# EAGLE design page1 (EAGLE 5.11)
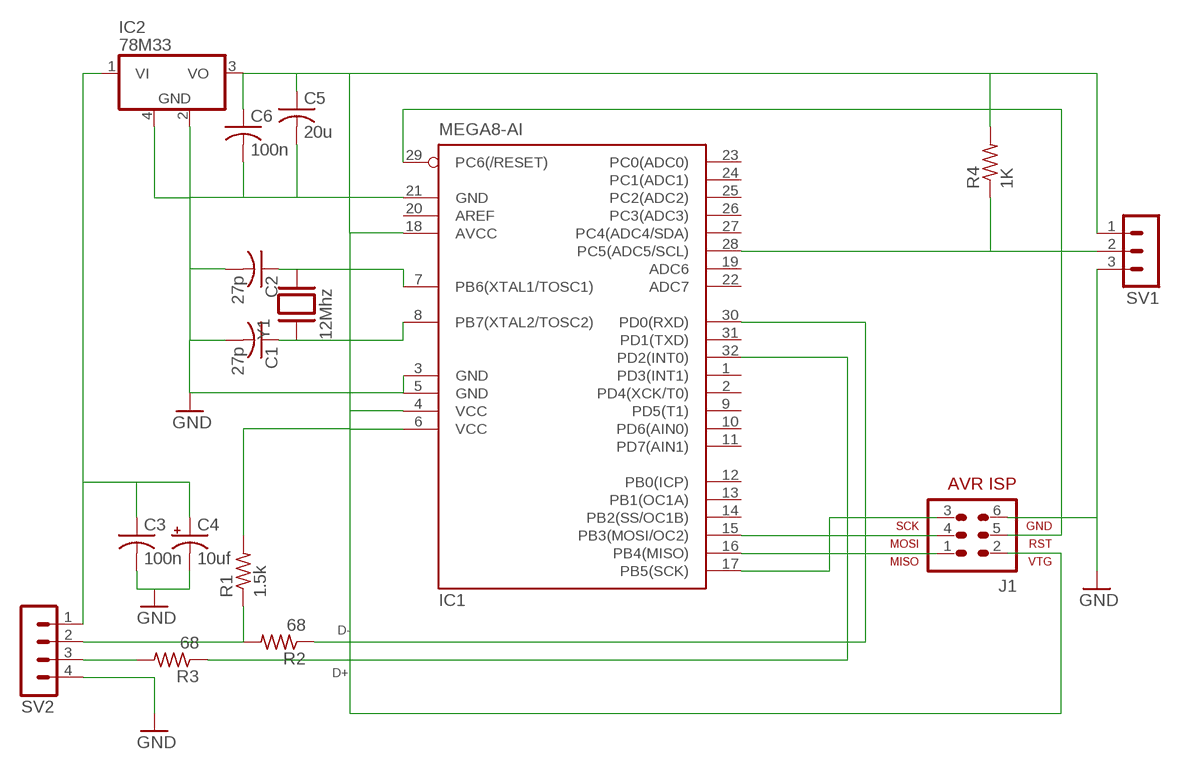
[diagram p0: schematic, sheet 1]

## Parts
C1  27p  C-USC0603  [C0603]
C2  27p  C-USC0603  [C0603]
C3  100n  C-USC1206  [C1206]
C4  10uf  CPOL-US085CS-1AR  [085CS_1AR]
C5  20u  C-USC2220K  [C2220K]
C6  100n  C-USC1206  [C1206]
IC1  MEGA8-AI  [TQFP32-08]
IC2  78M33  LM340MP-05  [SOT223]
J1  AVR-ISP-6  [AVR-ISP-6]
R1  1.5k  R-US_R0805  [R0805]
R2  68  R-US_R0805  [R0805]
R3  68  R-US_R0805  [R0805]
R4  1K  R-US_R0805  [R0805]
SV1  MA03-1  [MA03-1]
SV2  MA04-1  [MA04-1]
Y1  12Mhz  X-TAL  [XTAL]

## Nets
D+: R3.2 SV2.3
D-: R1.1 R2.2 SV2.2
GND: C1.2 C2.2 C3.2 C4.- C5.2 C6.2 IC1.3(GND) IC1.5(GND) IC1.21(GND) IC2.2(GND1) IC2.4(GND) J1.6 SV1.3 SV2.4
MISO: IC1.16(PB4(MISO)) J1.1
MOSI: IC1.15(PB3(MOSI/OC2)) J1.4
N$1: C3.1 C4.+ IC2.1(VI) SV2.1
N$3: C2.1 IC1.7(PB6(XTAL1/TOSC1)) Y1.P$2
N$4: C1.1 IC1.8(PB7(XTAL2/TOSC2)) Y1.P$1
N$10: IC1.30(PD0(RXD)) R2.1
N$12: IC1.32(PD2(INT0)) R3.1
N$21: IC1.28(PC5(ADC5/SCL)) R4.1 SV1.2
RST: IC1.29(PC6(/RESET)) J1.5
SCK: IC1.17(PB5(SCK)) J1.3
V3_3: C5.1 C6.1 IC1.4(VCC) IC1.6(VCC) IC1.18(AVCC) IC2.3(VO) J1.2 R1.2 R4.2 SV1.1
Unconnected: IC1.1(PD3(INT1)) IC1.2(PD4(XCK/T0)) IC1.9(PD5(T1)) IC1.10(PD6(AIN0)) IC1.11(PD7(AIN1)) IC1.12(PB0(ICP)) IC1.13(PB1(OC1A)) IC1.14(PB2(SS/OC1B)) IC1.19(ADC6) IC1.20(AREF) IC1.22(ADC7) IC1.23(PC0(ADC0)) IC1.24(PC1(ADC1)) IC1.25(PC2(ADC2)) IC1.26(PC3(ADC3)) IC1.27(PC4(ADC4/SDA)) IC1.31(PD1(TXD))

## Notes on the sheet
- D-
- D+

## Library data of the parts
C1-C3 C5 C6 = rcl:C-US: CAPACITOR, American symbol
C4 = rcl:CPOL-US: POLARIZED CAPACITOR, American symbol
IC1 = atmel:MEGA8: MICROCONTROLLER 8 Kbytes FLASH, 1 kbytes SRAM, 512 bytes EEPROM, USART, 6-channel 10 bit ADC, 2-channel 8 bit ADC Pin compatible with Atmega48, ATMega88, ATMega168 Source: avr.lbr; MPN: ATMEGA8-16AU; OC_FARNELL: 9171371; OC_NEWARK: 73M8863
IC2 = MY_ATMEL:LM340?-*: Positive VOLTAGE REGULATOR Source: http://cache.national.com/ds/LM/LM340.pdf
J1 = atmel2:AVR-ISP-6: AVR ISP-6 Serial Programming Header
R1-R4 = rcl:R-US_: RESISTOR, American symbol
SV1 = con-lstb:MA03-1: PIN HEADER; OC_FARNELL: unknown; OC_NEWARK: unknown
SV2 = con-lstb:MA04-1: PIN HEADER; OC_FARNELL: unknown; OC_NEWARK: unknown
Y1 = dedenbear:X-TAL

## Board
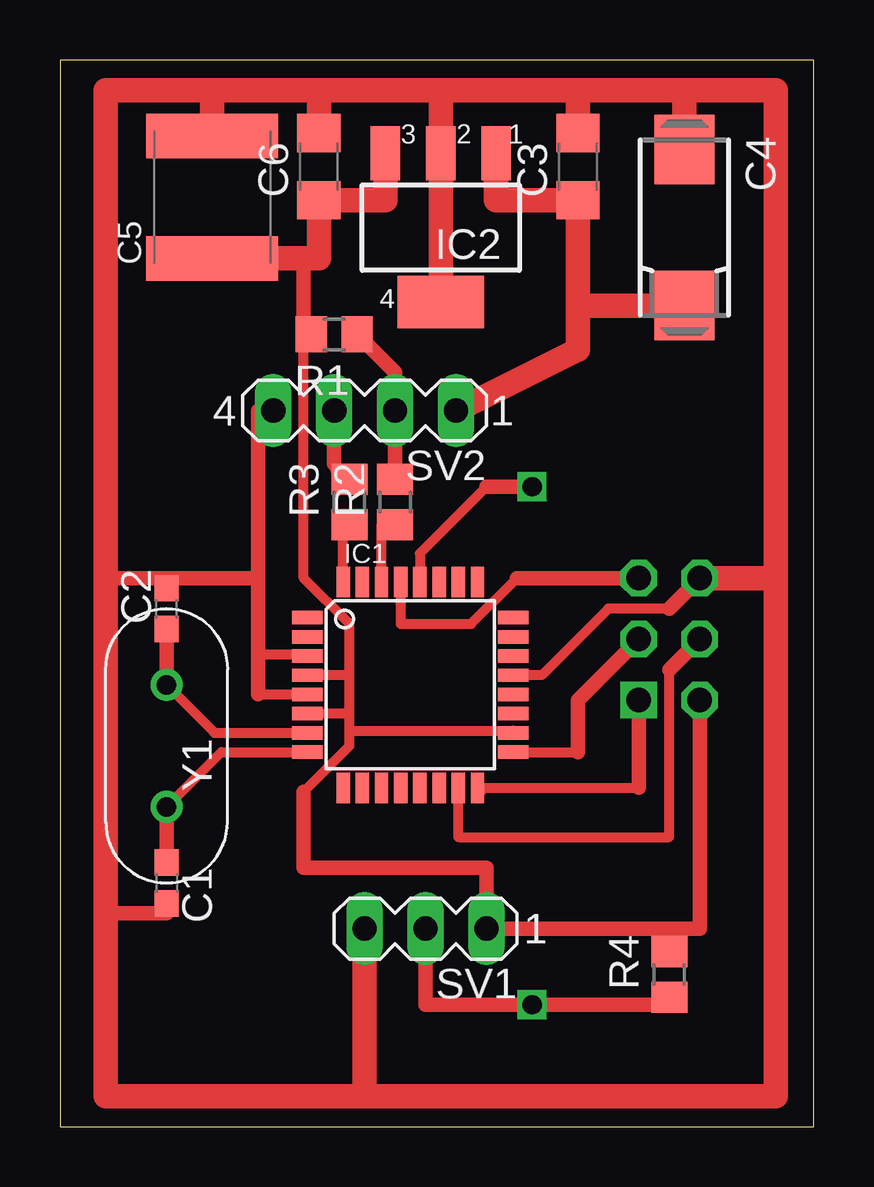
[diagram p1: board, top side]
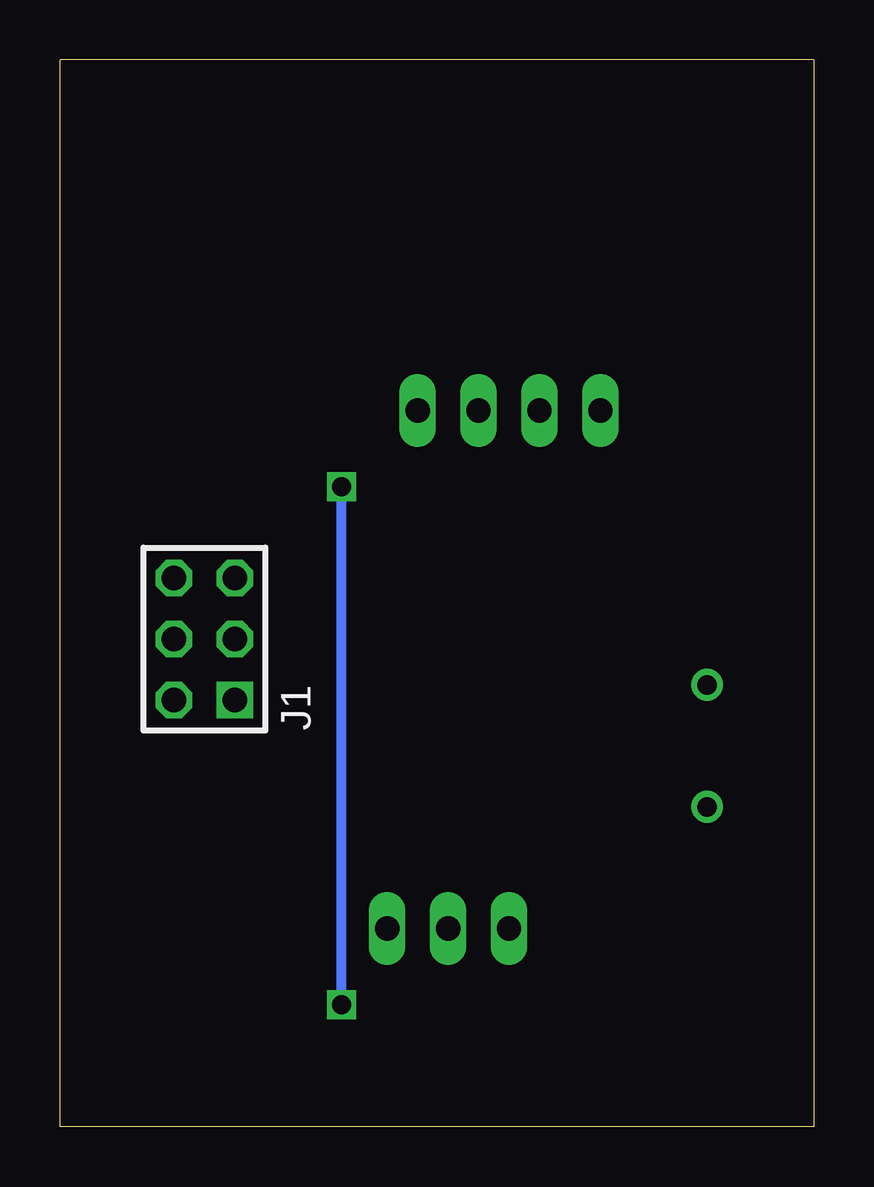
[diagram p2: board, bottom side, seen from below]

Size 31.42 x 44.45 mm. Coordinates in mm from the lower left corner, seen from the top.
Outline: 31.42,44.44 31.42,0 0,0 0,44.44
Outline: 0,44.45 31.42,44.45
Copper layers (1*16): Top 0.035mm / dielectric 1.5mm / Bottom 0.035mm
Design rules "default *": minimum track width 10mil, minimum drill 24mil, track to track 16mil, track to pad 16mil, pad to pad 16mil, via to via 8mil, smd to smd 16mil, copper to edge 40mil, drill to drill 8mil, minimum pad ring 10mil, minimum via ring 8mil, stop-mask expansion 4mil, vias tented up to drill 0mil, thermal gap 10mil

### Footprints (pad centres in the part's own frame; a part is rotated, then mirrored left to right if it is on the bottom)
C0603 = smd 1.1 x 1: 1 -0.85,0; 2 0.85,0
C1206 = smd 1.6 x 1.8: 1 -1.4,0; 2 1.4,0
085CS_1AR = smd 2.9 x 2.5: + 3.25,0; - -3.25,0
C2220K = smd 1.85 x 5.5: 1 -2.55,0; 2 2.55,0
TQFP32-08 = smd 1.27 x 0.559: 1 -4.293,2.8; 2 -4.293,2; 3 -4.293,1.2; 4 -4.293,0.4; 5 -4.293,-0.4; 6 -4.293,-1.2; 7 -4.293,-2; 8 -4.293,-2.8; 17 4.293,-2.8; 18 4.293,-2; 19 4.293,-1.2; 20 4.293,-0.4; 21 4.293,0.4; 22 4.293,1.2; 23 4.293,2; 24 4.293,2.8 | smd 0.559 x 1.27: 9 -2.8,-4.293; 10 -2,-4.293; 11 -1.2,-4.293; 12 -0.4,-4.293; 13 0.4,-4.293; 14 1.2,-4.293; 15 2,-4.293; 16 2.8,-4.293; 25 2.8,4.293; 26 2,4.293; 27 1.2,4.293; 28 0.4,4.293; 29 -0.4,4.293; 30 -1.2,4.293; 31 -2,4.293; 32 -2.8,4.293
SOT223 = smd 1.219 x 2.235: 1 -2.311,-3.099; 2 0,-3.099; 3 2.311,-3.099 | smd 3.6 x 2.2: 4 0,3.099
AVR-ISP-6 = drill 1.016 square: 1 -2.54,-1.27 | drill 1.016 octagon: 2 -2.54,1.27; 3 0,-1.27; 4 0,1.27; 5 2.54,-1.27; 6 2.54,1.27
R0805 = smd 1.3 x 1.5: 1 -0.95,0; 2 0.95,0
MA03-1 = drill 1.016 long: 1 -2.54,0; 2 0,0; 3 2.54,0
MA04-1 = drill 1.016 long: 1 -3.81,0; 2 -1.27,0; 3 1.27,0; 4 3.81,0
XTAL = drill 0.813: P$1 -2.54,0; P$2 2.54,0

### Placement (x,y rotation side)
C1  4.45,10.16 270 top
C2  4.45,21.59 90 top
C3  21.59,40 90 top
C4  26.03,37.46 270 top
C5  6.35,38.73 90 top
C6  10.79,40 90 top
IC1  14.6,18.41 0 top
IC2  15.88,37.46 180 top
J1  25.4,20.32 90 bottom
R1  11.43,33.02 180 top
R2  13.97,26.03 90 top
R3  12.06,26.03 90 top
R4  25.4,6.35 90 top
SV1  15.24,8.25 180 top
SV2  12.7,29.84 180 top
Y1  4.45,15.88 90 top

### Tracks (layer width: path | path; a pad name or v marks a point on that pad's centre or on a via)
D+
  Top 0.406: R3.2 arc-90 11.43,27.62
  Top 0.61: 11.43,27.62 SV2.3
D-
  Top 0.61: R2.2 SV2.2 13.97,31.43 R1.1
GND
  Top 0.406: IC2.2 15.88,40.64 | 8.25,18.02 IC1.5 | 8.25,19.69 10.31,19.69 IC1.3 | IC1.21 20.09,18.81 22.86,21.59 25.4,21.59 | 4.45,22.86 C2.2 | 4.45,8.89 C1.2 | C3.2 21.59,41.27
  Top 0.61: 8.25,18.02 8.25,19.69 8.25,22.86 | J1.6 25.4,21.59 | 1.9,22.86 4.45,22.86 8.25,22.86 | 1.9,8.89 4.45,8.89 | 8.25,22.86 8.25,29.84 SV2.4
  Top 1.016: IC2.4 IC2.2 15.88,43.18 | 12.7,1.27 1.9,1.27 1.9,8.89 1.9,22.86 1.9,43.18 6.35,43.18 | 29.84,22.86 29.84,1.27 12.7,1.27 | 29.84,22.86 J1.6 | 12.7,1.27 SV1.3 | 26.03,43.18 29.84,43.18 29.84,22.86 | 15.88,43.18 21.59,43.18 | 6.35,43.18 10.79,43.18 | 6.35,43.18 C5.2 | 10.79,43.18 C6.2 | 10.79,43.18 15.88,43.18 | 21.59,43.18 C3.2 | 26.03,43.18 C4.- | 26.03,43.18 21.59,43.18
MISO
  Top 0.406: 17.56,13.97 IC1.16 24.13,14.12
  Top 0.61: 24.13,14.12 J1.1
MOSI
  Top 0.406: IC1.15 16.6,12.06 25.4,12.06 25.4,19.05
  Top 0.61: 25.4,19.05 J1.4
N$1
  Top 0.406: 18.19,41.35 IC2.1 17.86,40.56 17.78,40.64
  Top 1.016: C4.+ 21.59,34.21 C3.1 | C3.1 18.19,38.6 IC2.1 | SV2.1 21.59,32.38 C3.1
N$3
  Top 0.406: IC1.7 6.45,16.41 Y1.P$2
  Top 0.61: Y1.P$2 C2.1
N$4
  Top 0.406: IC1.8 6.72,15.62 Y1.P$1
  Top 0.61: C1.1 Y1.P$1
N$10
  Top 0.406: IC1.30 13.4,25.09 R2.1
N$12
  Top 0.406: IC1.32 11.8,25.09 R3.1
N$21  (via drill 0.8)
  Top 0.406: IC1.28 15,23.89 17.78,26.67 | 25.4,5.08 R4.1
  Top 0.61: v19.69,26.67 17.78,26.67 | SV1.2 15.24,5.08 v19.69,5.08 25.4,5.08
  Bottom 0.406: v19.69,5.08 v19.69,26.67
RST
  Top 0.406: IC1.29 14.2,20.95 17.14,20.95 19.05,22.86
  Top 0.61: 19.05,22.86 J1.5
SCK
  Top 0.406: IC1.17 21.59,15.62
  Top 0.61: 21.59,15.62 21.59,17.78 J1.3
V3_3
  Top 0.406: 12.06,17.21 IC1.6 | 12.06,18.81 IC1.4 | 12.06,17.21 12.06,18.81 | 12.06,16.51 12.06,17.21 | 12.06,16.51 18.9,16.51 IC1.18 | 12.06,16.51 12.06,15.88 10.16,13.97 | 12.06,18.81 12.06,20.95 10.16,22.86 10.16,33.02 R1.2 | C5.1 | 25.4,8.25 R4.2
  Top 0.61: J1.2 26.67,8.25 25.4,8.25 SV1.1 17.78,10.79 10.16,10.79 10.16,13.97 | 10.16,33.02 10.16,36.2
  Top 1.016: C5.1 10.16,36.2 10.79,36.2 C6.1 13.56,38.6 IC2.3